# EAGLE schematic Esquemático v2 v34 (EAGLE 9.7.0)
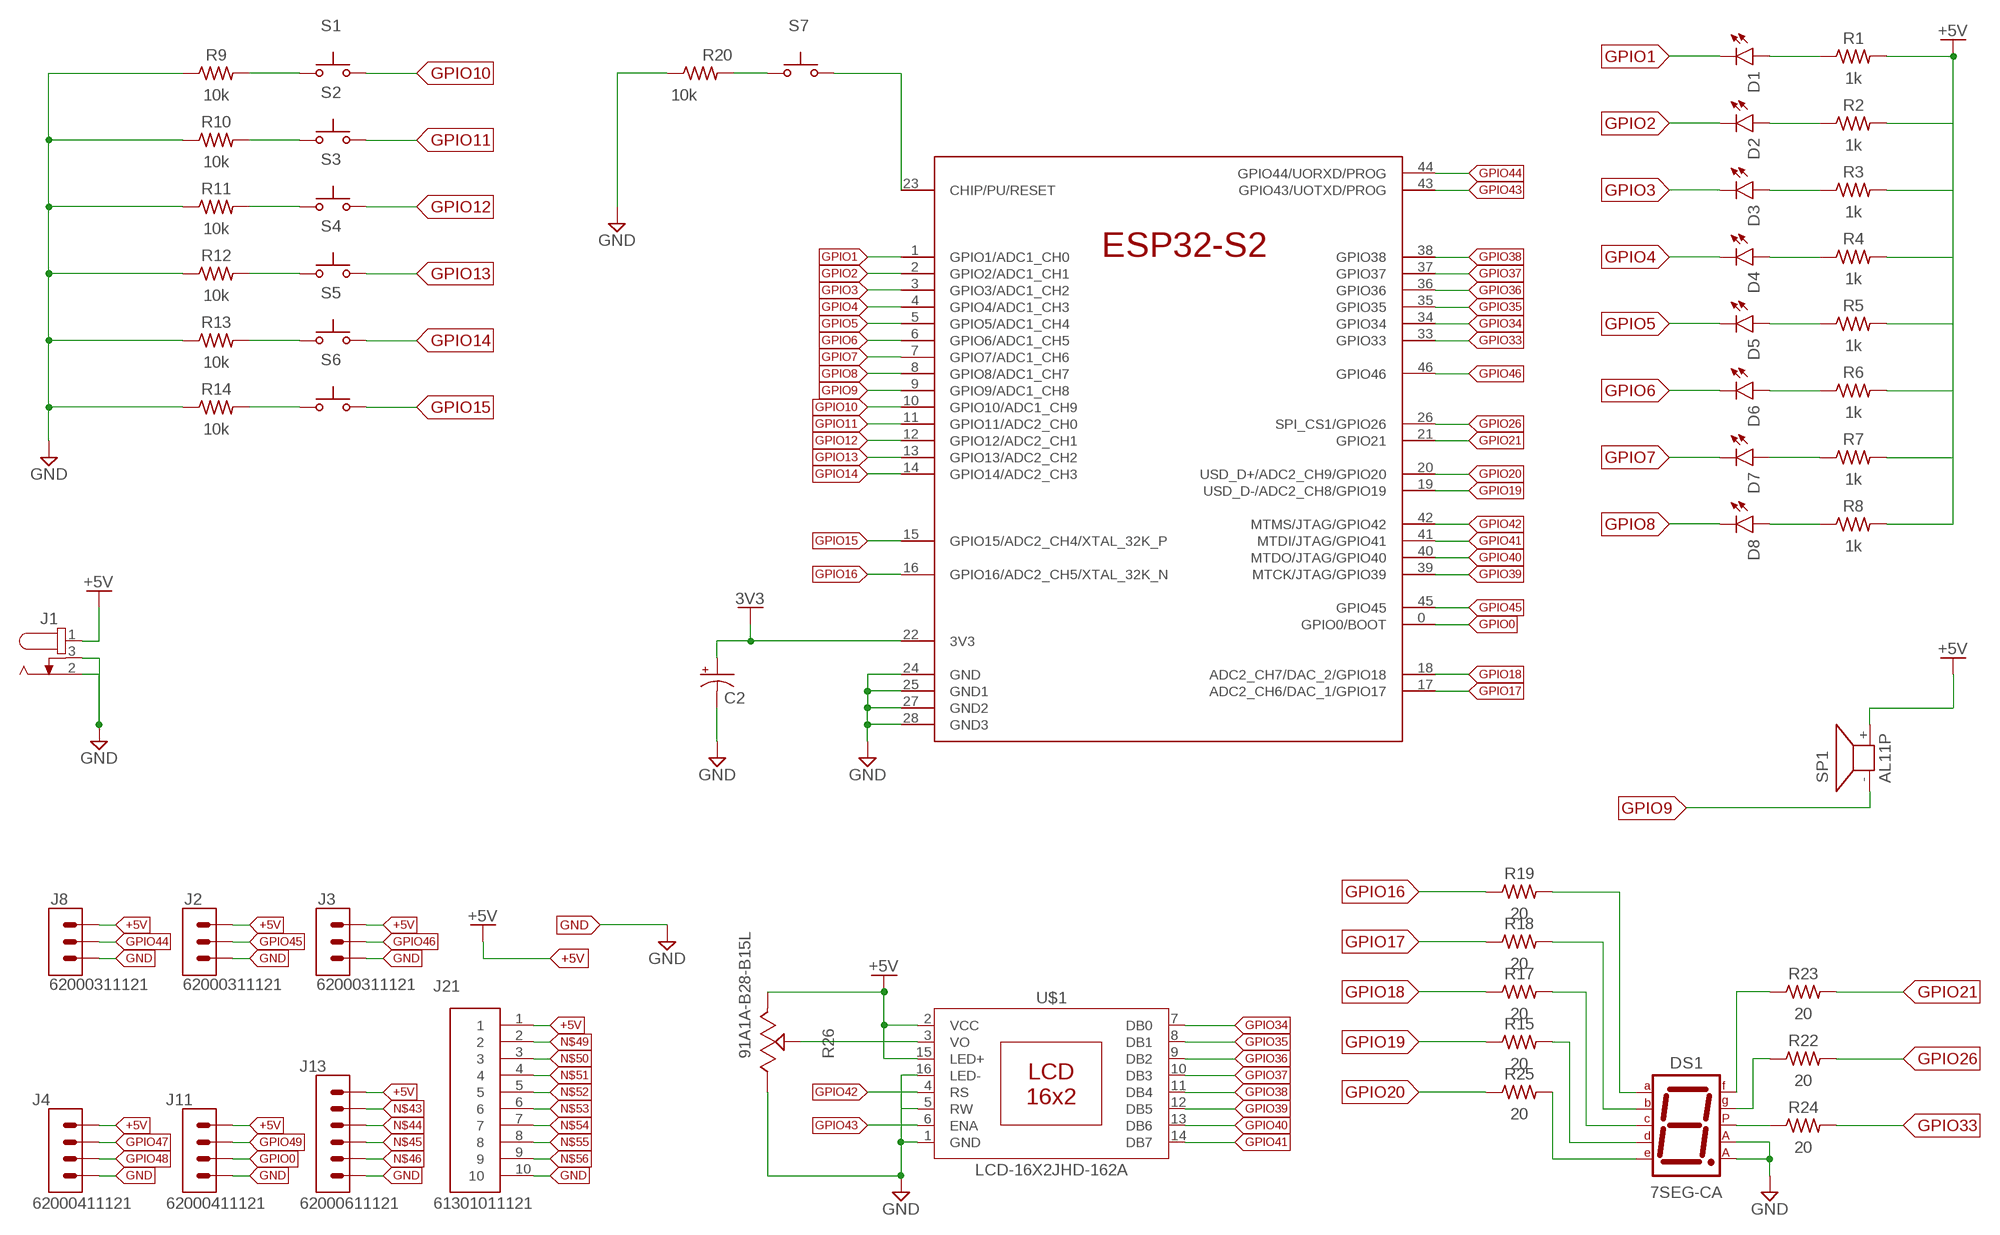
[diagram p0: schematic, sheet 1]

## Parts
C2  C-POL-US_RADIAL-11MM-DIA  [CAPPRD508W65D1000H1100B]
D1  LED_RADIAL  [LEDRD254W60D565H860B_G]
D2  LED_RADIAL  [LEDRD254W60D565H860B_G]
D3  LED_RADIAL  [LEDRD254W60D565H860B_G]
D4  LED_RADIAL  [LEDRD254W60D565H860B_G]
D5  LED_RADIAL  [LEDRD254W60D565H860B_G]
D6  LED_RADIAL  [LEDRD254W60D565H860B_G]
D7  LED_RADIAL  [LEDRD254W60D565H860B_G]
D8  LED_RADIAL  [LEDRD254W60D565H860B_G]
DS1  7SEG-CA  [7SEG-13]
J1  694106402002  [694106402002]
J2  62000311121  [62000311121]
J3  62000311121  [62000311121]
J4  62000411121  [62000411121]
J8  62000311121  [62000311121]
J11  62000411121  [62000411121]
J13  62000611121  [62000611121]
J21  61301011121  [61301011121]
R1  1k  R-US_AXIAL-11.7MM-PITCH  [RESAD1176W63L850D250B]
R2  1k  R-US_AXIAL-11.7MM-PITCH  [RESAD1176W63L850D250B]
R3  1k  R-US_AXIAL-11.7MM-PITCH  [RESAD1176W63L850D250B]
R4  1k  R-US_AXIAL-11.7MM-PITCH  [RESAD1176W63L850D250B]
R5  1k  R-US_AXIAL-11.7MM-PITCH  [RESAD1176W63L850D250B]
R6  1k  R-US_AXIAL-11.7MM-PITCH  [RESAD1176W63L850D250B]
R7  1k  R-US_AXIAL-11.7MM-PITCH  [RESAD1176W63L850D250B]
R8  1k  R-US_AXIAL-11.7MM-PITCH  [RESAD1176W63L850D250B]
R9  10k  R-US_AXIAL-11.7MM-PITCH  [RESAD1176W63L850D250B]
R10  10k  R-US_AXIAL-11.7MM-PITCH  [RESAD1176W63L850D250B]
R11  10k  R-US_AXIAL-11.7MM-PITCH  [RESAD1176W63L850D250B]
R12  10k  R-US_AXIAL-11.7MM-PITCH  [RESAD1176W63L850D250B]
R13  10k  R-US_AXIAL-11.7MM-PITCH  [RESAD1176W63L850D250B]
R14  10k  R-US_AXIAL-11.7MM-PITCH  [RESAD1176W63L850D250B]
R15  20  R-US_AXIAL-11.7MM-PITCH  [RESAD1176W63L850D250B]
R17  20  R-US_AXIAL-11.7MM-PITCH  [RESAD1176W63L850D250B]
R18  20  R-US_AXIAL-11.7MM-PITCH  [RESAD1176W63L850D250B]
R19  20  R-US_AXIAL-11.7MM-PITCH  [RESAD1176W63L850D250B]
R20  10k  R-US_AXIAL-7.2MM-PITCH  [RESAD724W46L381D178B]
R22  20  R-US_AXIAL-11.7MM-PITCH  [RESAD1176W63L850D250B]
R23  20  R-US_AXIAL-11.7MM-PITCH  [RESAD1176W63L850D250B]
R24  20  R-US_AXIAL-11.7MM-PITCH  [RESAD1176W63L850D250B]
R25  20  R-US_AXIAL-11.7MM-PITCH  [RESAD1176W63L850D250B]
R26  91A1A-B28-B15L  [91A1A-B28-B15L-ND]
S1  SWITCH-OMRON_B3U-1000P  [SWITCH-OMRON_B3U-1000P]
S2  SWITCH-OMRON_B3U-1000P  [SWITCH-OMRON_B3U-1000P]
S3  SWITCH-OMRON_B3U-1000P  [SWITCH-OMRON_B3U-1000P]
S4  SWITCH-OMRON_B3U-1000P  [SWITCH-OMRON_B3U-1000P]
S5  SWITCH-OMRON_B3U-1000P  [SWITCH-OMRON_B3U-1000P]
S6  SWITCH-OMRON_B3U-1000P  [SWITCH-OMRON_B3U-1000P]
S7  SWITCH-OMRON_B3U-1000P  [SWITCH-OMRON_B3U-1000P]
SP1  AL11P  [AL11P]
U1  ESP32  [QFN48-0.4MM]
U$1  LCD-16X2JHD-162A  [JHD-162A]

## Nets
3V3: C2.1(+) U1.22(3V3)
+5V: J1.1 J2.1 J3.1 J4.1 J8.1 J11.1 J13.1 J21.1 R1.2 R2.2 R3.2 R4.2 R5.2 R6.2 R7.2 R8.2 R26.1 SP1.+ U$1.2(VCC) U$1.15(LED+)
GND: C2.2(-) DS1.3(CA1) DS1.8(CA2) J1.2 J1.3 J2.3 J3.3 J4.4 J8.3 J11.4 J13.6 J21.10 R9.1 R10.1 R11.1 R12.1 R13.1 R14.1 R20.1 R26.3 U1.24(GND) U1.25(GND1) U1.27(GND2) U1.28(GND3) U$1.1(GND) U$1.5(RW) U$1.16(LED-)
GPIO0: J11.3 U1.0(GPIO0/BOOT)
GPIO1: D1.2(C) U1.1(GPIO1/ADC1_CH0)
GPIO2: D2.2(C) U1.2(GPIO2/ADC1_CH1)
GPIO3: D3.2(C) U1.3(GPIO3/ADC1_CH2)
GPIO4: D4.2(C) U1.4(GPIO4/ADC1_CH3)
GPIO5: D5.2(C) U1.5(GPIO5/ADC1_CH4)
GPIO6: D6.2(C) U1.6(GPIO6/ADC1_CH5)
GPIO7: D7.2(C) U1.7(GPIO7/ADC1_CH6)
GPIO8: D8.2(C) U1.8(GPIO8/ADC1_CH7)
GPIO9: SP1.- U1.9(GPIO9/ADC1_CH8)
GPIO10: S1.P$3(S) U1.10(GPIO10/ADC1_CH9)
GPIO11: S2.P$3(S) U1.11(GPIO11/ADC2_CH0)
GPIO12: S3.P$3(S) U1.12(GPIO12/ADC2_CH1)
GPIO13: S4.P$3(S) U1.13(GPIO13/ADC2_CH2)
GPIO14: S5.P$3(S) U1.14(GPIO14/ADC2_CH3)
GPIO15: S6.P$3(S) U1.15(GPIO15/ADC2_CH4/XTAL_32K_P)
GPIO16: R19.1 U1.16(GPIO16/ADC2_CH5/XTAL_32K_N)
GPIO17: R18.1 U1.17(ADC2_CH6/DAC_1/GPIO17)
GPIO18: R17.1 U1.18(ADC2_CH7/DAC_2/GPIO18)
GPIO19: R15.1 U1.19(USD_D-/ADC2_CH8/GPIO19)
GPIO20: R25.1 U1.20(USD_D+/ADC2_CH9/GPIO20)
GPIO21: R23.2 U1.21(GPIO21)
GPIO26: R22.2 U1.26(SPI_CS1/GPIO26)
GPIO33: R24.2 U1.33(GPIO33)
GPIO34: U1.34(GPIO34) U$1.7(DB0)
GPIO35: U1.35(GPIO35) U$1.8(DB1)
GPIO36: U1.36(GPIO36) U$1.9(DB2)
GPIO37: U1.37(GPIO37) U$1.10(DB3)
GPIO38: U1.38(GPIO38) U$1.11(DB4)
GPIO39: U1.39(MTCK/JTAG/GPIO39) U$1.12(DB5)
GPIO40: U1.40(MTDO/JTAG/GPIO40) U$1.13(DB6)
GPIO41: U1.41(MTDI/JTAG/GPIO41) U$1.14(DB7)
GPIO42: U1.42(MTMS/JTAG/GPIO42) U$1.4(RS)
GPIO43: U1.43(GPIO43/UOTXD/PROG) U$1.6(ENA)
GPIO44: J8.2 U1.44(GPIO44/UORXD/PROG)
GPIO45: J2.2 U1.45(GPIO45)
GPIO46: J3.2 U1.46(GPIO46)
GPIO47: J4.2
GPIO48: J4.3
GPIO49: J11.2
N$1: D1.1(A) R1.1
N$2: D2.1(A) R2.1
N$3: D3.1(A) R3.1
N$4: D4.1(A) R4.1
N$5: D5.1(A) R5.1
N$6: D6.1(A) R6.1
N$7: D7.1(A) R7.1
N$8: D8.1(A) R8.1
N$10: R9.2 S1.P$1(P)
N$11: R10.2 S2.P$1(P)
N$12: R11.2 S3.P$1(P)
N$13: R12.2 S4.P$1(P)
N$14: R13.2 S5.P$1(P)
N$15: R14.2 S6.P$1(P)
N$16: DS1.1(E) R25.2
N$17: DS1.2(D) R15.2
N$18: DS1.4(C) R17.2
N$19: DS1.6(B) R18.2
N$20: DS1.7(A) R19.2
N$21: DS1.10(G) R22.1
N$22: DS1.9(F) R23.1
N$23: DS1.5(DP) R24.1
N$24: R26.2 U$1.3(VO)
N$25: S7.P$3(S) U1.23(CHIP/PU/RESET)
N$27: R20.2 S7.P$1(P)
N$43: J13.2
N$44: J13.3
N$45: J13.4
N$46: J13.5
N$49: J21.2
N$50: J21.3
N$51: J21.4
N$52: J21.5
N$53: J21.6
N$54: J21.7
N$55: J21.8
N$56: J21.9

## Library data of the parts
C2 = Capacitor:C-POL-US: Capacitor Polarised - ANSI; CATEGORY: Capacitor
D1-D8 = Library:LED_RADIAL: LED - Generic
DS1 = Opto-Electronic:7SEG-CA: 7-segment DISPLAY single anode, 13 mm; CATEGORY: Opto-Electronic; SUB-CATEGORY: Display; TYPE: 7-Segment
J1 = Connector:694106402002: DC POWER JACK - VERTICAL - THT - 2.0 & 2.5Ø - WR-DC Details see: Datasheet <https://katalog.we-online.com/en/em/DC_THT_VERTICAL_6_4_69410X402002>; CATEGORY: Connector; DESCRIPTION: DC POWER JACK - VERTICAL - THT - 2.0 & 2.5Ø - WR-DC; MANUFACTURER: Würth Elektronik; MPN: 694106402002; OPERATING_TEMPERATURE: -40°C to +85°C; PART_STATUS: Active; ROHS_COMPLIANCE: RoHS Compliant; SERIES: WR-DC; SUBCATEGORY: Power Connector; TYPE: Vertical
J2 J3 J8 = Headers:62000311121: THT Vertical Pin Header WR-PHD, Pitch 2.00 mm, Single Row, 3 pins Manufacturer's datasheet <https://datasheet.octopart.com/62000311121-W%C3%BCrth-Elektronik-datasheet-117282002.pdf>; CREATED_BY: PCBLayout.com; MANUFACTURER: Würth Elektronik; MPN: 62000311121
J4 J11 = Headers:62000411121: THT Vertical Pin Header WR-PHD, Pitch 2.00 mm, Single Row, 4 pins Manufacturer's datasheet <https://datasheet.octopart.com/62000411121-W%C3%BCrth-Elektronik-datasheet-117282003.pdf>; CREATED_BY: PCBLayout.com; MANUFACTURER: Würth Elektronik; MPN: 62000411121
J13 = Headers:62000611121: THT Vertical Pin Header WR-PHD, Pitch 2.00 mm, Single Row, 6 pins Manufacturer's datasheet <https://datasheet.octopart.com/62000611121-W%C3%BCrth-Elektronik-datasheet-117282008.pdf>; CREATED_BY: PCBLayout.com; MANUFACTURER: Würth Elektronik; MPN: 62000611121
J21 = Headers:61301011121: CONN HEADER VERT 10POS 2.54MM Manufacturer's datasheet <https://katalog.we-online.de/em/datasheet/6130xx11121.pdf>; CREATED_BY: PCBLayout.com; DIGIKEY_PART_NUMBER: 732-2670-ND; MANUFACTURER: Wurth Electronics Inc.; MPN: 61301011121
R1-R15 R17-R19 R22-R25 = Resistor:R-US: Resistor Fixed - ANSI; CATEGORY: Resistor; SUB-CATEGORY: Fixed
R20 = Resistor:R-US: Resistor Fixed - ANSI; CATEGORY: Resistor; SPICEPREFIX: R; SUB-CATEGORY: Fixed
R26 = Potentiometer_Trimmers:91A1A-B28-B15L: POT 10K OHM 1W PLASTIC LINEAR Manufacturer's datasheet <https://www.bourns.com/docs/Product-Datasheets/91_95.pdf>; CREATED_BY: PCBLayout.com; DIGIKEY_PARTNO: 91A1A-B28-B15L-ND; MANUFACTURER: Bourns Inc.; MPN: 91A1A-B28-B15L
S1-S7 = 52101-101-REV-A_v16:SWITCH-OMRON_B3U-1000P: SMD Tactile Switch - Ultra Small
SP1 = buzzer:AL11P: SPEAKER Source: Buerklin; OC_FARNELL: unknown; OC_NEWARK: unknown
U1 = ESP32-S2:ESP32: Espressif ESP32 WiFi-compatible SoC microcontroller. Bluetooth Low energy support (BLE, BT4.0, Bluetooth Smart) 28 GPIO pins Dual-core Tensilica LX6 microprocessor Hardware accelerated encryption (AES, SHA2, ECC, RSA-4096) 4MB Flash memory 520kB internal SRAM Datasheet <https://cdn.sparkfun.com/datasheets/IoT/esp32_datasheet_en.pdf> SparkFun Products: SparkFun ESP32 Thing <https://www.sparkfun.com/products/13907>; PROD_ID: IC-13338
U$1 = Tinkercad:LCD-16X2